# EAGLE design uni2bi (EAGLE 9.6.2)
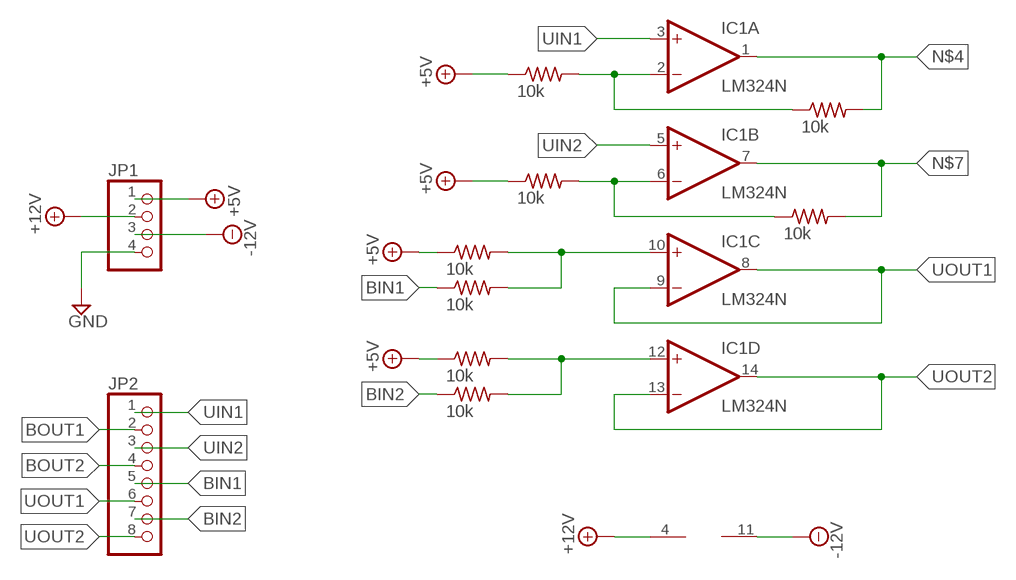
[diagram p0: schematic, sheet 1]

## Parts
IC1  LM324N  [DIL14]
JP1  PINHD-1X4  [1X04]
JP2  PINHD-1X8  [1X08]
R3  10k  R-US_0207/10  [0207/10]
R4  10k  R-US_0207/10  [0207/10]
R5  10k  R-US_0207/10  [0207/10]
R6  10k  R-US_0207/10  [0207/10]
R7  10k  R-US_0207/10  [0207/10]
R8  10k  R-US_0207/10  [0207/10]
R9  10k  R-US_0207/10  [0207/10]
R10  10k  R-US_0207/10  [0207/10]

## Nets
+5V: JP1.1 R3.1 R7.1 R8.1 R9.1
+12V: IC1.4(P:V+) JP1.2
-12V: IC1.11(P:V-) JP1.3
BIN1: JP2.5 R4.1
BIN2: JP2.7 R5.1
BOUT1: IC1.2(A:-IN) JP2.2 R8.2 R10.1
BOUT2: IC1.6(B:-IN) JP2.4 R6.1 R7.2
GND: JP1.4
N$1: IC1.10(C:+IN) R4.2 R9.2
N$2: IC1.12(D:+IN) R3.2 R5.2
N$4: IC1.1(A:OUT) R10.2
N$7: IC1.7(B:OUT) R6.2
UIN1: IC1.3(A:+IN) JP2.1
UIN2: IC1.5(B:+IN) JP2.3
UOUT1: IC1.8(C:OUT) IC1.9(C:-IN) JP2.6
UOUT2: IC1.13(D:-IN) IC1.14(D:OUT) JP2.8

## Library data of the parts
IC1 = linear:LM324: OP AMP
JP1 = pinhead:PINHD-1X4: PIN HEADER
JP2 = pinhead:PINHD-1X8: PIN HEADER
R3-R10 = adafruit:R-US_: RESISTOR, American symbol

## Board
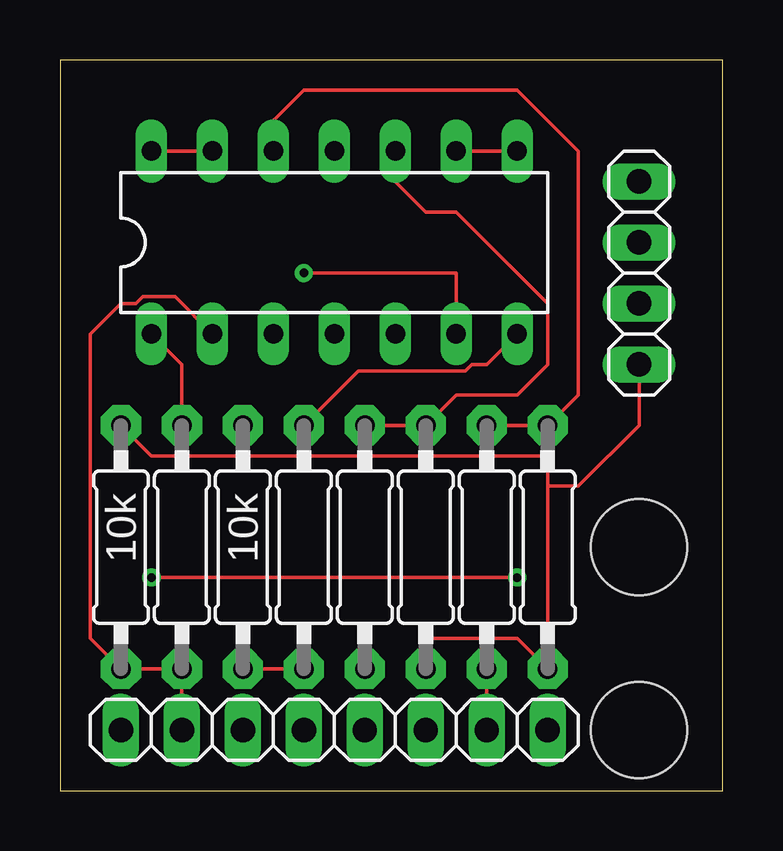
[diagram p1: board, top side]
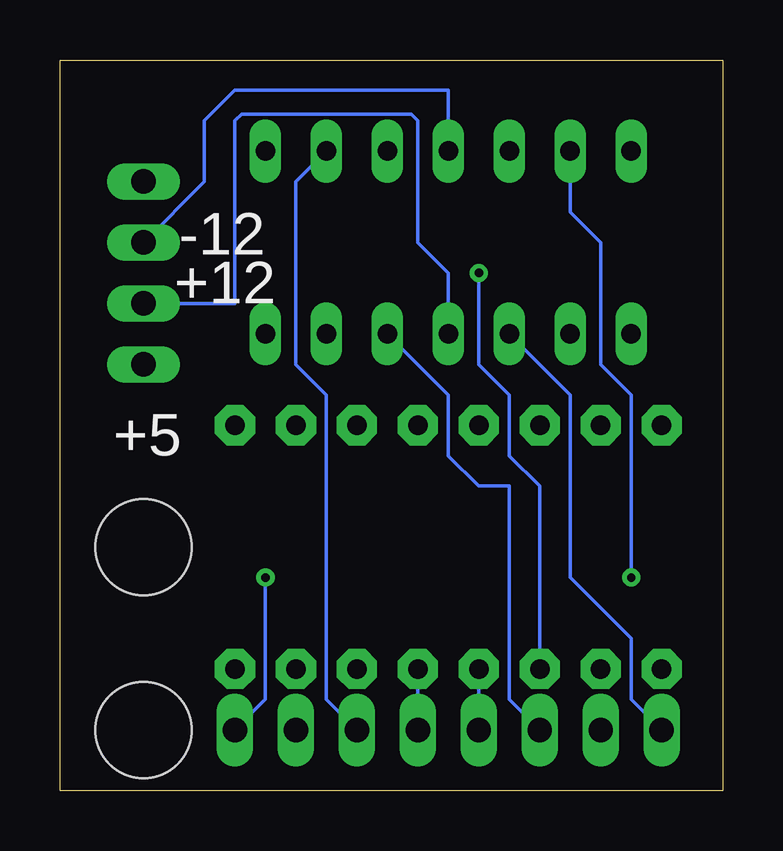
[diagram p2: board, bottom side, seen from below]

Size 27.61 x 30.47 mm. Coordinates in mm from the lower left corner, seen from the top.
Outline: 0,0 27.61,0 27.61,30.47 0,30.47 0,0
Copper layers (1*16): Top 0.035mm / dielectric 1.5mm / Bottom 0.035mm
Design rules "default": minimum track width 6mil, minimum drill 0.35mm, track to track 6mil, track to pad 6mil, pad to pad 6mil, via to via 6mil, smd to smd 6mil, copper to edge 40mil, drill to drill 6mil, minimum pad ring 10mil, minimum via ring 8mil, stop-mask expansion 4mil, vias tented up to drill 0mil, thermal gap 10mil
Holes 4 mm at 24.13,2.54 24.13,10.16

### Footprints (pad centres in the part's own frame; a part is rotated, then mirrored left to right if it is on the bottom)
DIL14 = drill 0.813 long: 1 -7.62,-3.81; 2 -5.08,-3.81; 3 -2.54,-3.81; 4 0,-3.81; 5 2.54,-3.81; 6 5.08,-3.81; 7 7.62,-3.81; 8 7.62,3.81; 9 5.08,3.81; 10 2.54,3.81; 11 0,3.81; 12 -2.54,3.81; 13 -5.08,3.81; 14 -7.62,3.81
1X04 = drill 1.016 long: 1 -3.81,0; 2 -1.27,0; 3 1.27,0; 4 3.81,0
1X08 = drill 1.016 long: 1 -8.89,0; 2 -6.35,0; 3 -3.81,0; 4 -1.27,0; 5 1.27,0; 6 3.81,0; 7 6.35,0; 8 8.89,0
0207/10 = drill 0.813 pad 1.676 octagon: 1 -5.08,0; 2 5.08,0

### Placement (x,y rotation side)
IC1  11.43,22.86 0 top
JP1  24.13,21.59 90 top
JP2  11.43,2.54 0 top
R3  20.32,10.16 90 top
R4  12.7,10.16 90 top
R5  17.78,10.16 90 top
R6  10.16,10.16 90 top
R7  7.62,10.16 270 top
R8  2.54,10.16 270 top
R9  15.24,10.16 90 top
R10  5.08,10.16 90 top

### Tracks (layer width: path | path; a pad name or v marks a point on that pad's centre or on a via)
+5V
  Top 0.152: 20.32,12.7 21.59,12.7 24.13,15.24 JP1.1 | 7.62,13.97 20.32,13.97 20.32,12.7 | 7.62,13.97 3.81,13.97 R8.1 | R7.1 7.62,13.97 | R9.1 15.24,6.35 19.05,6.35 R3.1 20.32,12.7
+12V
  Bottom 0.152: IC1.4 11.43,21.59 12.7,22.86 12.7,27.94 12.98,28.22 20.04,28.22 20.32,27.94 20.32,20.32 JP1.2
-12V
  Bottom 0.152: IC1.11 11.43,29.21 20.32,29.21 21.59,27.94 21.59,25.4 JP1.3
BIN1
  Bottom 0.152: JP2.5 R4.1
BIN2
  Top 0.152: R5.1 JP2.7
BOUT1
  Top 0.152: JP2.2 R10.1 R8.2 1.27,6.35 1.27,19.05 2.54,20.32 3.16,20.32 3.44,20.6 4.8,20.6 IC1.2
BOUT2  (via drill 0.35)
  Top 0.152: v10.16,21.59 16.51,21.59 IC1.6 | R7.2 R6.1
  Bottom 0.152: R7.2 7.62,12.7 8.89,13.97 8.89,16.51 10.16,17.78 v10.16,21.59 | JP2.4 R6.1
N$1
  Top 0.152: R4.2 R9.2 16.51,16.51 19.05,16.51 20.32,17.78 20.32,20.32 16.51,24.13 15.24,24.13 13.97,25.4 IC1.10
N$2
  Top 0.152: R5.2 R3.2 21.59,16.51 21.59,26.67 19.05,29.21 10.16,29.21 8.89,27.94 IC1.12
N$4
  Top 0.152: IC1.1 5.08,17.78 R10.2
N$7
  Top 0.152: IC1.7 17.78,17.78 17.16,17.78 16.88,17.5 12.42,17.5 R6.2
UIN1
  Bottom 0.152: IC1.3 6.35,16.51 6.35,8.89 3.81,6.35 3.81,3.81 JP2.1
UIN2
  Bottom 0.152: JP2.3 8.89,3.81 8.89,12.7 10.16,12.7 11.43,13.97 11.43,16.51 IC1.5
UOUT1
  Top 0.152: IC1.9 IC1.8
  Bottom 0.152: JP2.6 16.51,3.81 16.51,16.51 17.78,17.78 17.78,25.4 IC1.9
UOUT2  (via drill 0.35)
  Top 0.152: IC1.13 IC1.14 | v3.81,8.89 v19.05,8.89
  Bottom 0.152: IC1.13 6.35,24.13 5.08,22.86 5.08,17.78 3.81,16.51 v3.81,8.89 | JP2.8 19.05,3.81 v19.05,8.89

### Text on the board
bNames: -12 | +12 | +5